# Altium schematic sheet V1_input_channel_noNegSply_sch.SchDoc
size A3; SheetNumber: 2; SheetTotal: 5
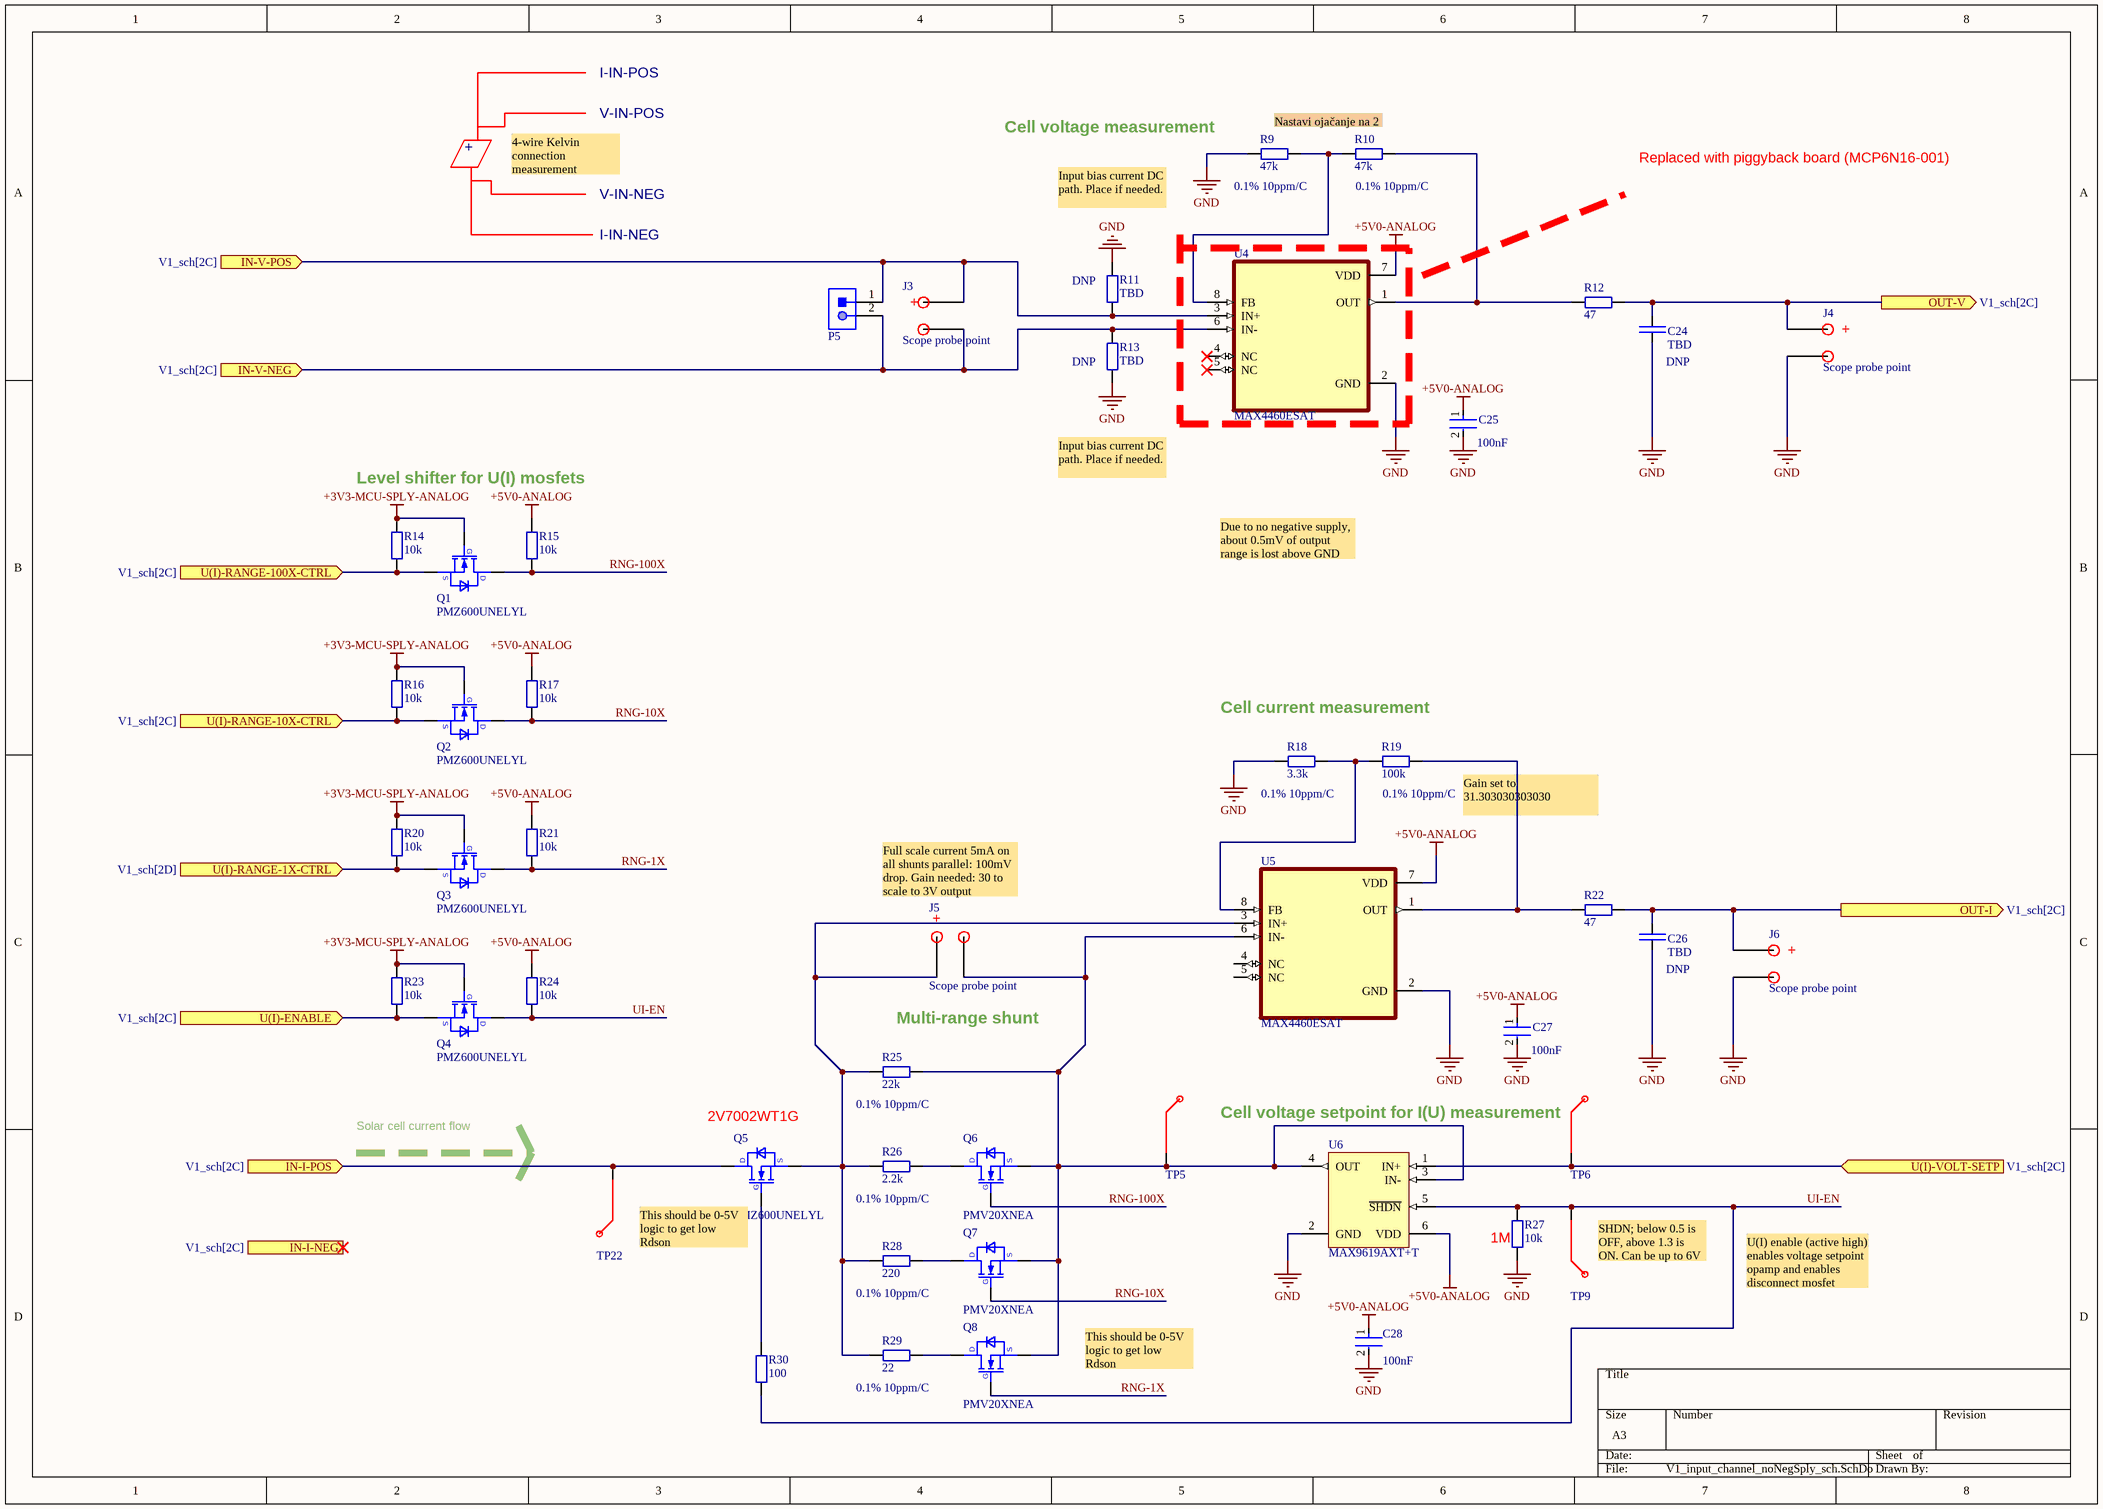
[diagram p0: V1_input_channel_noNegSply_sch.SchDoc]

## Parts
C24  value TBD  [FPR_0603_C_R0]  (hidden comment: PN_C0603_TBD)
C25  Capacitance: 100nF  [FP-885012206095-IPC_B]  (hidden comment: 885012206095)
C26  value TBD  [FPR_0603_C_R0]  (hidden comment: PN_C0603_TBD)
C27  Capacitance: 100nF  [FP-885012206095-IPC_B]  (hidden comment: 885012206095)
C28  Capacitance: 100nF  [FP-885012206095-IPC_B]  (hidden comment: 885012206095)
J3  Scope probe point  [scope with ground spring probe point]
J4  Scope probe point  [scope with ground spring probe point]
J5  Scope probe point  [scope with ground spring probe point]
J6  Scope probe point  [scope with ground spring probe point]
P5  61300211121  [61300211121]  (value not drawn)
Q1  PMZ600UNELYL  [DFN985X585X50-3N + SC-70 backup]
Q2  PMZ600UNELYL  [DFN985X585X50-3N + SC-70 backup]
Q3  PMZ600UNELYL  [DFN985X585X50-3N + SC-70 backup]
Q4  PMZ600UNELYL  [DFN985X585X50-3N + SC-70 backup]
Q5  PMZ600UNELYL  [DFN985X585X50-3N + SC-70 backup]
Q6  PMV20XNEA  [SOT-23 for nexperia mosfets]
Q7  PMV20XNEA  [SOT-23 for nexperia mosfets]
Q8  PMV20XNEA  [SOT-23 for nexperia mosfets]
R9  value 47k  Tolerance: 0.1% 10ppm/C  [FPR_0603_R_R0]  (hidden comment: PN_R0603_47k_0%1_10ppm)
R10  value 47k  Tolerance: 0.1% 10ppm/C  [FPR_0603_R_R0]  (hidden comment: PN_R0603_47k_0%1_10ppm)
R11  value TBD  [FPR_0805_R_R0]  (hidden comment: PN_R0603_TBD)
R12  value 47  [FPR_0603_R_R0]  (hidden comment: PN_R0603_TBD)
R13  value TBD  [FPR_0805_R_R0]  (hidden comment: PN_R0603_TBD)
R14  value 10k  [FPR_0603_R_R0]  (hidden comment: PN_R0603_10k)
R15  value 10k  [FPR_0603_R_R0]  (hidden comment: PN_R0603_10k)
R16  value 10k  [FPR_0603_R_R0]  (hidden comment: PN_R0603_10k)
R17  value 10k  [FPR_0603_R_R0]  (hidden comment: PN_R0603_10k)
R18  value 3.3k  Tolerance: 0.1% 10ppm/C  [FPR_0603_R_R0]  (hidden comment: PN_R0603_3k3_0%1_10ppm)
R19  value 100k  Tolerance: 0.1% 10ppm/C  [FPR_0603_R_R0]  (hidden comment: PN_R0603_100k_0%1_10ppm)
R20  value 10k  [FPR_0603_R_R0]  (hidden comment: PN_R0603_10k)
R21  value 10k  [FPR_0603_R_R0]  (hidden comment: PN_R0603_10k)
R22  value 47  [FPR_0603_R_R0]  (hidden comment: PN_R0603_TBD)
R23  value 10k  [FPR_0603_R_R0]  (hidden comment: PN_R0603_10k)
R24  value 10k  [FPR_0603_R_R0]  (hidden comment: PN_R0603_10k)
R25  value 22k  Tolerance: 0.1% 10ppm/C  [FPR_0603_R_R0]  (hidden comment: PN_R0603_22K_0%1_10ppm)
R26  value 2.2k  Tolerance: 0.1% 10ppm/C  [FPR_0603_R_R0]  (hidden comment: PN_R0603_2K2_0%1_10ppm)
R27  value 10k  [FPR_0603_R_R0]  (hidden comment: PN_R0603_10k)
R28  value 220  Tolerance: 0.1% 10ppm/C  [FPR_0603_R_R0]  (hidden comment: PN_R0603_220R_0%1_10ppm)
R29  value 22  Tolerance: 0.1% 10ppm/C  [FPR_0603_R_R0]  (hidden comment: PN_R0603_22R_0%1_10ppm)
R30  value 100  [FPR_0603_R_R0]  (hidden comment: PN_R0603_100R)
TP5  Test Point  [Test Point 1.5mm SMD]  (value not drawn)
TP6  Test Point  [Test Point 1.5mm SMD]  (value not drawn)
TP9  Test Point  [Test Point 1.5mm SMD]  (value not drawn)
TP22  Test Point  [Test Point 1.5mm SMD]  (value not drawn)
U4  MAX4460ESAT  [SOIC127P600X175-8N]
U5  MAX4460ESAT  [SOIC127P600X175-8N]
U6  MAX9619AXT+T  [X6SN+1_N]

## Ports
IN-I-NEG (in, see V1_sch[2C]), IN-I-POS (in, see V1_sch[2C]), IN-V-NEG (in, see V1_sch[2C]), IN-V-POS (in, see V1_sch[2C]), OUT-I (out, see V1_sch[2C]), OUT-V (out, see V1_sch[2C]), U(I)-ENABLE (in, see V1_sch[2C]), U(I)-RANGE-1X-CTRL (in, see V1_sch[2D]), U(I)-RANGE-10X-CTRL (in, see V1_sch[2C]), U(I)-RANGE-100X-CTRL (in, see V1_sch[2C]), U(I)-VOLT-SETP (in, see V1_sch[2C])

## Nets
+3V3-MCU-SPLY-ANALOG: Q1.1(GATE) Q2.1(GATE) Q3.1(GATE) Q4.1(GATE) R14.2 R16.2 R20.2 R23.2
+5V0-ANALOG: C25.1 C27.1 C28.1 R15.2 R17.2 R21.2 R24.2 U4.7(VDD) U5.7(VDD) U6.6(VDD)
GND: C24.1 C25.2 C26.1 C27.2 C28.2 J4.NEG J6.NEG R9.2 R11.2 R13.1 R18.2 R27.1 U4.2(GND) U5.2(GND) U6.2(GND)
IN-I-POS: Q5.3(DRAIN) TP22.1 ; port IN-I-POS
IN-V-NEG: J3.NEG P5.2 R13.2 U4.6(IN-) ; port IN-V-NEG
IN-V-POS: J3.POS P5.1 R11.1 U4.3(IN+) ; port IN-V-POS
OUT-I: C26.2 J6.POS R22.1 ; port OUT-I
OUT-V: C24.2 J4.POS R12.1 ; port OUT-V
RNG-1X: Q3.3(DRAIN) Q8.1(GATE) R21.1
RNG-10X: Q2.3(DRAIN) Q7.1(GATE) R17.1
RNG-100X: Q1.3(DRAIN) Q6.1(GATE) R15.1
U(I)-ENABLE: Q4.2(SOURCE) R23.1 ; port U(I)-ENABLE
U(I)-RANGE-1X-CTRL: Q3.2(SOURCE) R20.1 ; port U(I)-RANGE-1X-CTRL
U(I)-RANGE-10X-CTRL: Q2.2(SOURCE) R16.1 ; port U(I)-RANGE-10X-CTRL
U(I)-RANGE-100X-CTRL: Q1.2(SOURCE) R14.1 ; port U(I)-RANGE-100X-CTRL
U(I)-VOLT-SETP: TP6.1 U6.1(IN+) ; port U(I)-VOLT-SETP
UI-EN: Q4.3(DRAIN) R24.1 R27.2 R30.1 TP9.1 U6.5(~{SHDN})
NetJ5_NEG: J5.NEG Q6.2(SOURCE) Q7.2(SOURCE) Q8.2(SOURCE) R25.1 TP5.1 U5.6(IN-) U6.3(IN-) U6.4(OUT)
NetJ5_POS: J5.POS Q5.2(SOURCE) R25.2 R26.2 R28.2 R29.2 U5.3(IN+)
NetQ5_1: Q5.1(GATE) R30.2
NetQ6_3: Q6.3(DRAIN) R26.1
NetQ7_3: Q7.3(DRAIN) R28.1
NetQ8_3: Q8.3(DRAIN) R29.1
NetR9_1: R9.1 R10.2 U4.8(FB)
NetR10_1: R10.1 R12.2 U4.1(OUT)
NetR18_1: R18.1 R19.2 U5.8(FB)
NetR19_1: R19.1 R22.2 U5.1(OUT)

Not connected (* = marked no-connect by the designer): U4 4(NC)* 5(NC)*; U5 4(NC) 5(NC)

## Notes on the sheet
- I-IN-POS
- V-IN-POS
- +
- 4-wire Kelvin connection measurement
- Cell voltage measurement
- Nastavi ojačanje na 2
- Replaced with piggyback board (MCP6N16-001)
- I-IN-NEG
- V-IN-NEG
- Input bias current DC path. Place if needed.
- Level shifter for U(I) mosfets
- Due to no negative supply, about 0.5mV of output range is lost above GND
- Cell current measurement
- Gain set to 31.303030303030
- (near J5) Full scale current 5mA on all shunts parallel: 100mV drop. Gain needed: 30 to scale to 3V output
- (near R25) Multi-range shunt
- Solar cell current flow
- (near Q5) 2V7002WT1G
- (near TP6) Cell voltage setpoint for I(U) measurement
- (near Q5) This should be 0-5V logic to get low Rdson
- (near R27) 1M
- (near TP9) SHDN; below 0.5 is OFF, above 1.3 is ON. Can be up to 6V
- U(I) enable (active high) enables voltage setpoint opamp and enables disconnect mosfet
- This should be 0-5V logic to get low Rdson
- (in symbol PMV20XNEA) D; S; G
- (in symbol PMZ600UNELYL) D; S; G
- (in symbol Scope probe point) +

## Library data of the parts
C24 C26 = C: Capacitor - generic SMD; DNP: DNP
C25 C27 C28 = CMP-207839-000004-1: CAP CER 0.1UF 50V X7R 0603; Tolerance: 10%; RoHS Compliant: Yes; Thickness: 0.037inch; Voltage Rating: 50V; Packaging: Cut Tape; Dielectric: X7R; Series: WCAP-CSGP; Width: 0.031inch; Max Operating Temperature: 125°C; Min Operating Temperature: -55°C; Case/Package: 0603; Case Code (Metric): 1608; Case Code (Imperial): 0603; Length: 0.063inch; Mount: Surface Mount; Voltage Rating (DC): 50V
P5 = CMP-1712-00002-4: THT Vertical Pin Header WR-PHD, Pitch 2.54 mm, Single Row, 2 pins; Manufacturer: Wurth Elektronik; Rated Current: 3A; Gender: Male; Withstanding Voltage: 500VAC; Working Voltage: 250VAC; Pitch: 2.54mm; Contact Resistance: 20mOhm; Pin Number: 2; Mounting Technology: THT; Orientation: Vertical; Operating Temperature: -40to105degC; Packaging: Bag; Publisher: WurthElektronik; Datasheet URL: https://katalog.we-online.de/em/datasheet/6130xx11121.pdf; Manufacturer URL: http://www.we-online.de; Row Number: Single; Package Reference: 61300211121; Part Number: 61300211121
Q1-Q5 = PMZ600UNELYL: Low leakage N mosfet
Q6-Q8 = PMV20XNEA: sot-23 N mosfet low Rdson
R9-R30 = R: Resistor - generic SMD
  R11 R13: DNP: DNP
U6 = CMP-0252-00044-1: 1.5MHz, High-Efficiency Single Op Amp with Zero-Drift and Rail to Rail IO, 6-Pin SC70, -40°C to +125°C, Pb-Free, Tape and Reel; ComponentLink2Description: Datasheet; ComponentLink3URL: http://pdfserv.maxim-ic.com/package_dwgs/21-0077.PDF; Code_JEDEC: MO-203; ComponentLink1URL: http://www.maxim-ic.com; ComponentLink3Description: Package Specification; ComponentLink2URL: http://datasheets.maxim-ic.com/en/ds/MAX9617-MAX9620.pdf; PackageVersion: revH, 2010; ComponentLink1Description: Manufacturer URL; PackageReference: X6SN+1; PackageDescription: 6-Pin SL70 Package 2 x 1.3 mm Body ,0.65 mm Pitch, Pb-Free; DatasheetVersion: Rev 5, Jul-2011
U4 U5 = MAX4460ESAT: Package: None; Price: None; Value: *; MP: MAX4460ESAT; Availability: Unavailable